# Altium schematic sheet LED_output.SchDoc
size A4; SheetNumber: 2; SheetTotal: 8
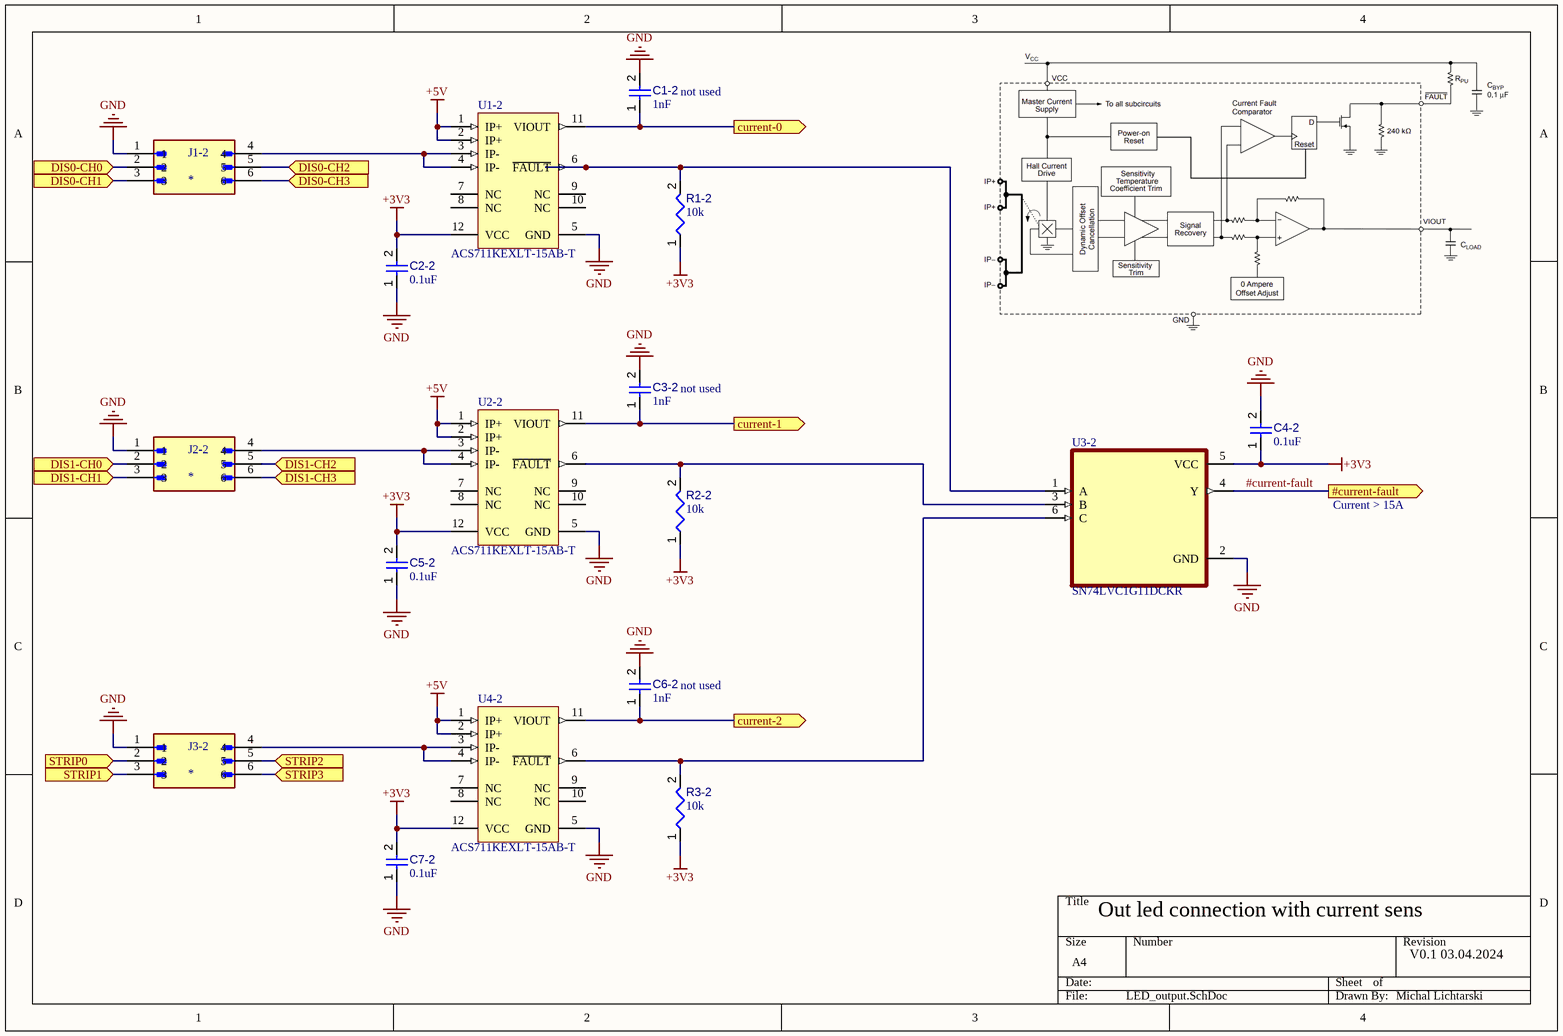
[diagram p0: LED_output.SchDoc]

## Parts
C1-2  value 1nF  [CAPC1608X94X35NL15T15]  (hidden comment: 1nF 0603)
C2-2  value 0.1uF  [CAPC1608X94X35NL15T15]  (hidden comment: 0.1uF 0603)
C3-2  value 1nF  [CAPC1608X94X35NL15T15]  (hidden comment: 1nF 0603)
C4-2  value 0.1uF  [CAPC1608X94X35NL15T15]  (hidden comment: 0.1uF 0603)
C5-2  value 0.1uF  [CAPC1608X94X35NL15T15]  (hidden comment: 0.1uF 0603)
C6-2  value 1nF  [CAPC1608X94X35NL15T15]  (hidden comment: 1nF 0603)
C7-2  value 0.1uF  [CAPC1608X94X35NL15T15]  (hidden comment: 0.1uF 0603)
J1-2  *  [MOLEX_874270602]
J2-2  *  [MOLEX_874270602]
J3-2  *  [MOLEX_874270602]
R1-2  value 10k  [RESC1608X55X25ML10T15]  (hidden comment: 10k 0603)
R2-2  value 10k  [RESC1608X55X25ML10T15]  (hidden comment: 10k 0603)
R3-2  value 10k  [RESC1608X55X25ML10T15]  (hidden comment: 10k 0603)
U1-2  ACS711KEXLT-15AB-T  [ALEG-EX-12_V]
U2-2  ACS711KEXLT-15AB-T  [ALEG-EX-12_V]
U3-2  SN74LVC1G11DCKR  [SOT65P210X110-6N]
U4-2  ACS711KEXLT-15AB-T  [ALEG-EX-12_V]

## Ports
#current-fault (out, see Sheet1[2B], ESP32[2B]), current-0 (out, see Sheet1[2B], ESP32[1B]), current-1 (out, see Sheet1[2B], ESP32[1B]), current-2 (out, see Sheet1[2B], ESP32[1B]), DIS0-CH0 (in, see Sheet1[2A], stm32[3C]), DIS0-CH1 (in, see Sheet1[2A], stm32[3D]), DIS0-CH2 (in, see Sheet1[2A], stm32[3D]), DIS0-CH3 (in, see Sheet1[2A], stm32[3D]), DIS1-CH0 (in, see Sheet1[2A], stm32[2A]), DIS1-CH1 (in, see Sheet1[2A], stm32[2A]), DIS1-CH2 (in, see Sheet1[2A], stm32[2B]), DIS1-CH3 (in, see Sheet1[2A], stm32[2B]), STRIP0 (in, see Sheet1[2A], stm32[4B]), STRIP1 (in, see Sheet1[2A], stm32[4B]), STRIP2 (in, see Sheet1[2A], stm32[4B]), STRIP3 (in, see Sheet1[2A], stm32[3A])

## Nets
+3V3: C2-2.2 C4-2.1 C5-2.2 C7-2.2 R1-2.1 R2-2.1 R3-2.1 U1-2.12(VCC) U2-2.12(VCC) U3-2.5(VCC) U4-2.12(VCC)
+5V: U1-2.1(IP+) U1-2.2(IP+) U2-2.1(IP+) U2-2.2(IP+) U4-2.1(IP+) U4-2.2(IP+)
GND: C1-2.2 C2-2.1 C3-2.2 C4-2.2 C5-2.1 C6-2.2 C7-2.1 J1-2.1 J2-2.1 J3-2.1 U1-2.5(GND) U2-2.5(GND) U3-2.2(GND) U4-2.5(GND)
#current-fault: U3-2.4(Y) ; port #current-fault
current-0: C1-2.1 U1-2.11(VIOUT) ; port current-0
current-1: C3-2.1 U2-2.11(VIOUT) ; port current-1
current-2: C6-2.1 U4-2.11(VIOUT) ; port current-2
DIS0-CH0: J1-2.2 ; port DIS0-CH0
DIS0-CH1: J1-2.3 ; port DIS0-CH1
DIS0-CH2: J1-2.5 ; port DIS0-CH2
DIS0-CH3: J1-2.6 ; port DIS0-CH3
DIS1-CH0: J2-2.2 ; port DIS1-CH0
DIS1-CH1: J2-2.3 ; port DIS1-CH1
DIS1-CH2: J2-2.5 ; port DIS1-CH2
DIS1-CH3: J2-2.6 ; port DIS1-CH3
STRIP0: J3-2.2 ; port STRIP0
STRIP1: J3-2.3 ; port STRIP1
STRIP2: J3-2.5 ; port STRIP2
STRIP3: J3-2.6 ; port STRIP3
NetJ1-2_4: J1-2.4 U1-2.3(IP-) U1-2.4(IP-)
NetJ2-2_4: J2-2.4 U2-2.3(IP-) U2-2.4(IP-)
NetJ3-2_4: J3-2.4 U4-2.3(IP-) U4-2.4(IP-)
NetR1-2_2: R1-2.2 U1-2.6(~{FAULT}) U3-2.1(A)
NetR2-2_2: R2-2.2 U2-2.6(~{FAULT}) U3-2.3(B)
NetR3-2_2: R3-2.2 U3-2.6(C) U4-2.6(~{FAULT})

Not connected (* = marked no-connect by the designer): U1-2 7(NC) 8(NC) 9(NC) 10(NC); U2-2 7(NC) 8(NC) 9(NC) 10(NC); U4-2 7(NC) 8(NC) 9(NC) 10(NC)

## Notes on the sheet
- (near C1-2) not used
- (near C3-2) not used
- Current > 15A
- (near C6-2) not used
- Out led connection with current sens
- V0.1 03.04.2024
- Michal Lichtarski

## Library data of the parts
C1-2 C2-2 C3-2 C4-2 C5-2 C6-2 C7-2 = CMP-001-00003-6: Tolerance: 10%; Voltage Rating: 16V; Capacitor Type: Ceramic; Max Operating Temperature: 125°C; Pins: 2; Min Operating Temperature: -55°C; RoHS Compliant: True; Mounting Technology: SM; Case/Package: 0603
J1-2 J2-2 J3-2 = 874270602: Price: None; Availability: Unavailable; MP: 874270602; Value: *; Package: None
R1-2 R2-2 R3-2 = CMP-009-00023-5: Voltage Rating: 50V; Tolerance: 1%; Power: 100mW; Max Operating Temperature: 155°C; RoHS Compliant: True; Pins: 2; Case/Package: 0603; Mounting Technology: SM; Min Operating Temperature: -55°C
U1-2 U2-2 U4-2 = CMP-1557-00001-1: Hall Effect Linear Current Sensor with Overcurrent Fault Output for <100 V Isolation Applications, 3 to 5.5 V, -15.5 to 15.5 A IP, -40 to 125 degC, 12-Pin QFN (EX), RoHS, Tape and Reel; VCC Max: 5.5 V; IP Max: 15.5 A; VCC Min: 3 V; IP Min: -15.5 A; -3dB Bandwidth: 0.1 MHz; PackageDescription: 12-Pin Quad Flat No-Lead, Body 3 x 3 mm, Height 0.8 mm; ComponentLink1URL: http://www.allegromicro.com/; Packing: Tape and Reel; ComponentLink2URL: http://www.allegromicro.com/~/media/Files/Datasheets/ACS711-Datasheet.ashx?la=en; DatasheetVersion: Rev. 3; PartNumber: ACS711KEXLT-15AB-T; ComponentLink2Description: Datasheet; ComponentLink3URL: http://www.allegromicro.com/~/media/Files/Datasheets/ACS711-Datasheet.ashx?la=en; RoHS: TRUE; ComponentLink1Description: Manufacturer URL; ComponentLink3Description: Package Specification; Temperature Max: 125 degC; Mounting Technology: Surface Mount; Temperature Min: -40 degC
U3-2 = SN74LVC1G11DCKR: MF: {'manufacturer': u'Texas Instruments'}; Package: None; Price: None; Value: *; MP: SN74LVC1G11DCKR; Availability: Unavailable